# Altium schematic sheet driver.SchDoc
size A4; Author: Omri Nissan; Organization: Altium Limited; Address1: -; Address2: San Luis Obispo; Address3: California, 93401; Address4: United States; DocumentNumber: 5; SheetNumber: 5; SheetTotal: 8
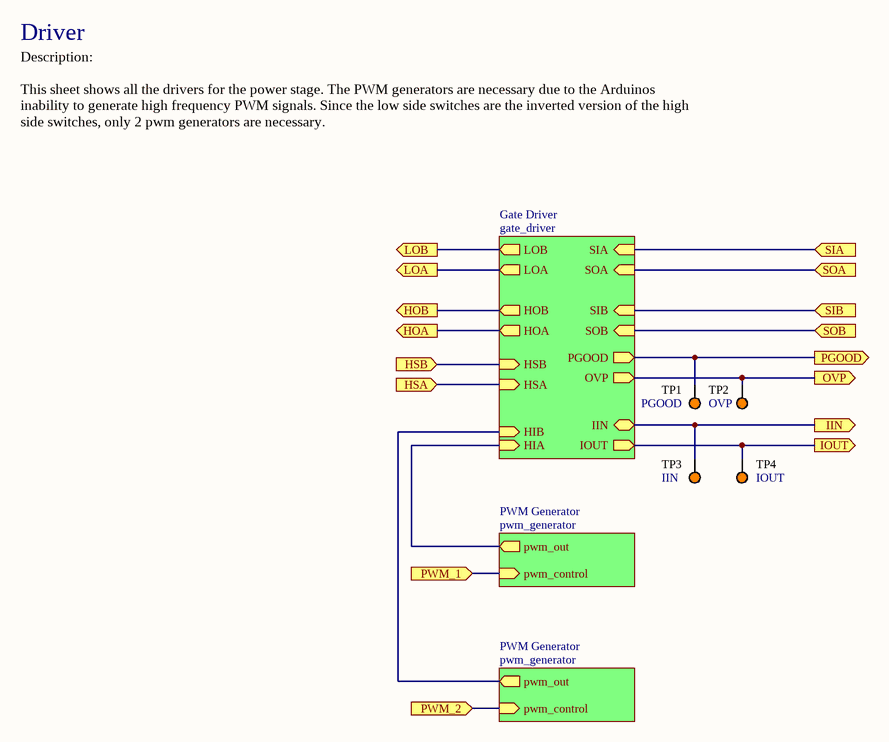
[diagram p0: driver.SchDoc]

## Parts
TP1  PGOOD  [KSTN-5013_V]
TP2  OVP  [KSTN-5013_V]
TP3  IIN  [KSTN-5013_V]
TP4  IOUT  [KSTN-5013_V]

## Sub-sheets
Gate Driver = gate_driver: HOB (out), LOA (out), LOB (out), HOA (out), HSB (in), IOUT (out), OVP (out), HSA (in), HIB (in), HIA (in), PGOOD (out), IIN (bidir), SOB (in), SIB (in), SIA (in), SOA (in)
PWM Generator = pwm_generator: pwm_out (out), pwm_control (in)
PWM Generator = pwm_generator: pwm_out (out), pwm_control (in)

## Ports
HOA (out), HOB (out), HSA (in), HSB (in), IIN (out), IOUT (out), LOA (out), LOB (out), OVP (out), PGOOD (out), PWM_1 (in), PWM_2 (in), SIA (in), SIB (in), SOA (in), SOB (in)

## Nets
HOA: port HOA, sheet Gate Driver/HOA
HOB: port HOB, sheet Gate Driver/HOB
HSA: port HSA, sheet Gate Driver/HSA
HSB: port HSB, sheet Gate Driver/HSB
IIN: TP3.1 ; port IIN, sheet Gate Driver/IIN
IOUT: TP4.1 ; port IOUT, sheet Gate Driver/IOUT
LOA: port LOA, sheet Gate Driver/LOA
LOB: port LOB, sheet Gate Driver/LOB
OVP: TP2.1 ; port OVP, sheet Gate Driver/OVP
PGOOD: TP1.1 ; port PGOOD, sheet Gate Driver/PGOOD
PWM_1: port PWM_1, sheet PWM Generator/pwm_control
PWM_2: port PWM_2, sheet PWM Generator/pwm_control
SIA: port SIA, sheet Gate Driver/SIA
SIB: port SIB, sheet Gate Driver/SIB
SOA: port SOA, sheet Gate Driver/SOA
SOB: port SOB, sheet Gate Driver/SOB
(unnamed): sheet PWM Generator/pwm_out, sheet Gate Driver/HIA
(unnamed): sheet Gate Driver/HIB, sheet PWM Generator/pwm_out

## Notes on the sheet
- Driver
- Description:
  This sheet shows all the drivers for the power stage. The PWM generators are necessary due to the Arduinos inability to generate high frequency PWM signals. Since the low side switches are the inverted version of the high side switches, only 2 pwm generators are necessary.
- Title
- Size:
- Date:
- A4
- Number:
- Time:
- Revision:
- Sheet
- of
- File:

## Library data of the parts
TP1-TP4 = CMP-1672-00005-4: Test Point, Orange, Through Hole, RoHS, Bulk; Manufacturer: Keystone; REACH SVHC: No SVHC; ComponentLink2Description: Datasheet; PackageDescription: 1-Pin Through Hole Device, Dia 3.17 mm; Package Quantity: 100; PackageReference: 5013; Contact Material: Bronze; DatasheetVersion: Rev. F, 12/2013; ComponentLink2URL: http://www.keyelco.com/product-pdf.cfm?p=1322; Contact Plating: Silver; ComponentLink1URL: http://www.keyelco.com/; Packaging: Bulk; ComponentLink1Description: Manufacturer URL; Colour: Orange; Height: 8.12 mm; RoHSCompliant: True; Mount: Through Hole; Mounting Technology: Through Hole